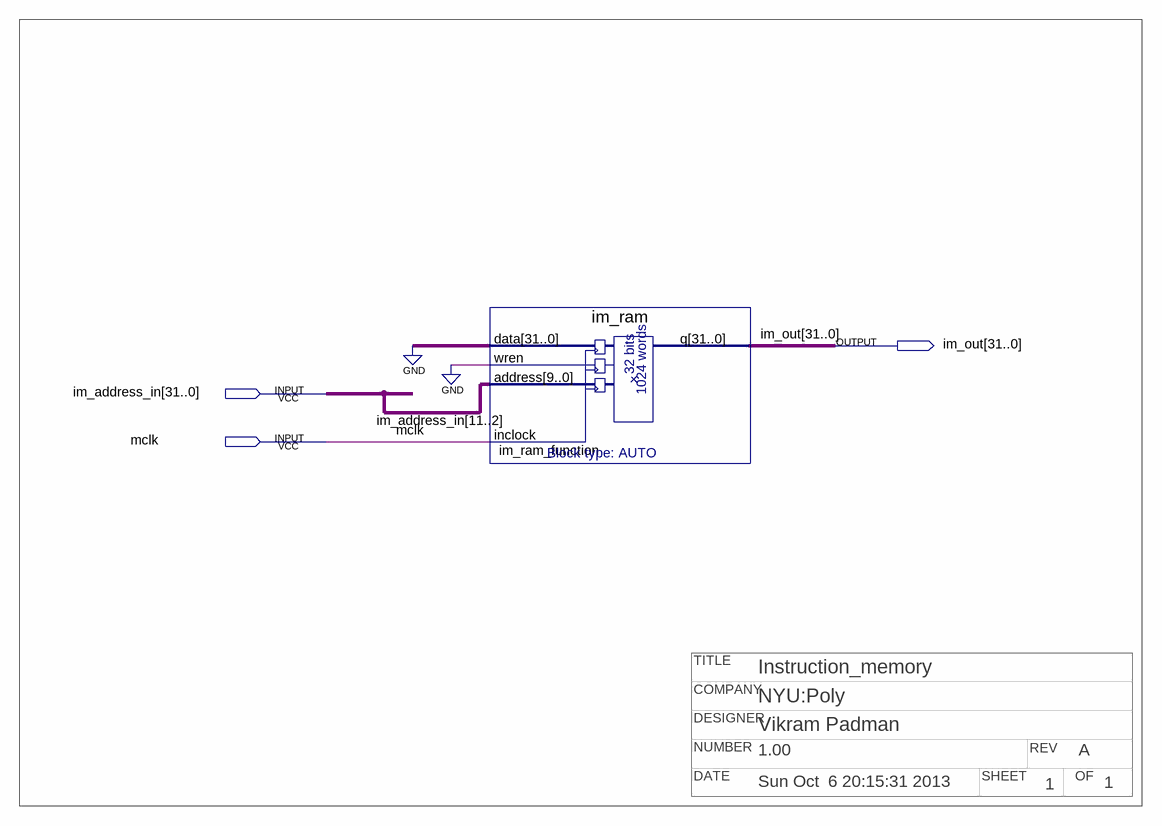
[diagram p0: schematic sheet]
// Quartus schematic im.bdf as structural Verilog: 1 symbols, 3 pins
// Title block: COMPANY: NYU:Poly; DATE: Sun Oct  6 20:15:31 2013; DESIGNER: Vikram Padman; NUMBER: 1.00; OF: 1; REV: A; SHEET: 1; TITLE: Instruction_memory
module im (
  input  [31:0] im_address_in,
  input  mclk,
  output [31:0] im_out
);

  im_ram im_ram_function (.data({32{1'b0}}), .wren(1'b0), .address(im_address_in[11:2]), .inclock(mclk), .q(im_out));
endmodule
